# Altium schematic sheet Humidtemp.SchDoc
size A4
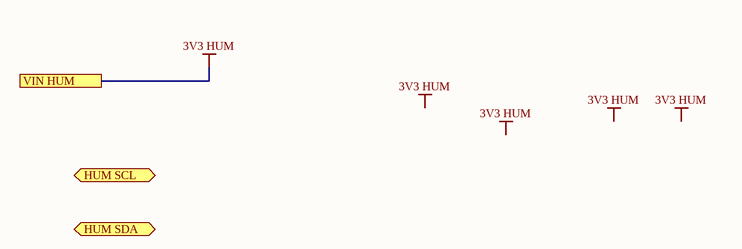
[diagram p0: Humidtemp.SchDoc]

## Ports
HUM SCL (bidir), HUM SDA (bidir), VIN HUM

## Nets
3V3 HUM: port VIN HUM

## Notes on the sheet
- Labels drawn without touching a wire or pin: 3V3 HUM